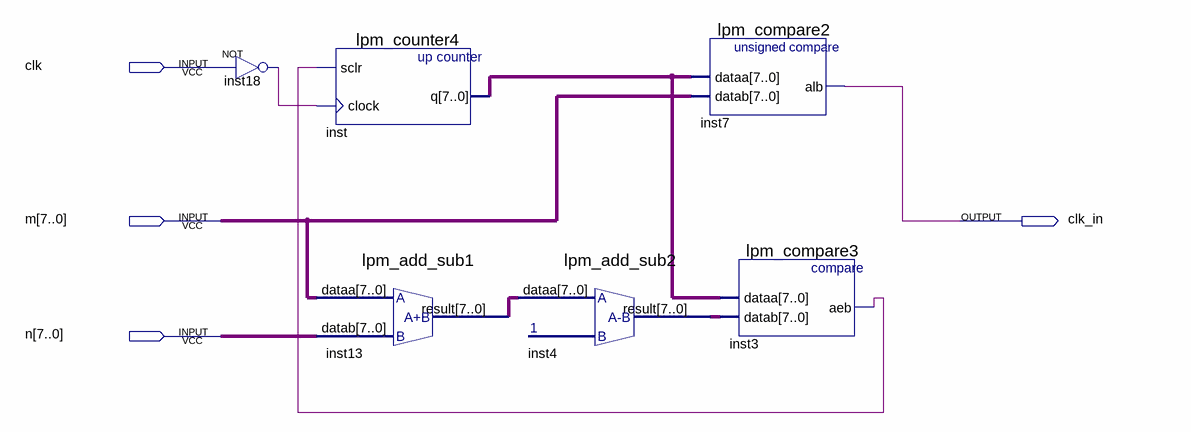
[diagram p0: schematic sheet]
// Quartus schematic block1_dop.bdf as structural Verilog: 6 symbols, 4 pins
module block1_dop (
  input  clk,
  input  [7:0] m,
  input  [7:0] n,
  output clk_in
);

  wire inst3_aeb, inst18_out;
  wire [7:0] inst4_result, inst13_result, inst_q;

  not inst18 (inst18_out, clk);
  lpm_counter4 inst (.sclr(inst3_aeb), .clock(inst18_out), .q(inst_q));
  lpm_add_sub1 inst13 (.dataa(m), .datab(n), .result(inst13_result));
  lpm_add_sub2 inst4 (.dataa(inst13_result), .result(inst4_result));
  lpm_compare2 inst7 (.dataa(inst_q), .datab(m), .alb(clk_in));
  lpm_compare3 inst3 (.dataa(inst_q), .datab(inst4_result), .aeb(inst3_aeb));
endmodule
